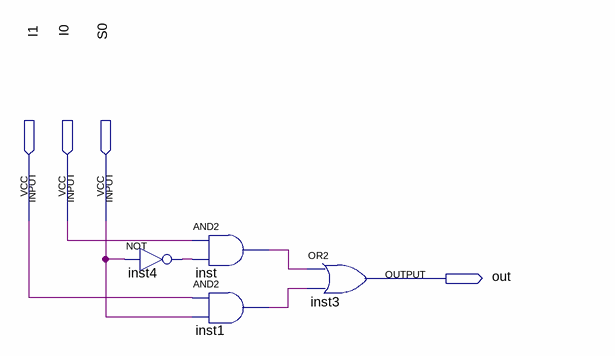
[diagram p0: schematic sheet]
// Quartus schematic Mux2_1.bdf as structural Verilog: 4 symbols, 4 pins
module Mux2_1 (
  input  I1,
  input  I0,
  input  S0,
  output out
);

  wire inst1_out, inst4_out, inst_out;

  and inst (inst_out, I0, inst4_out);
  not inst4 (inst4_out, S0);
  and inst1 (inst1_out, I1, S0);
  or inst3 (out, inst_out, inst1_out);
endmodule
